# EAGLE design Pro_Shield_V2 (EAGLE 7.1.0)
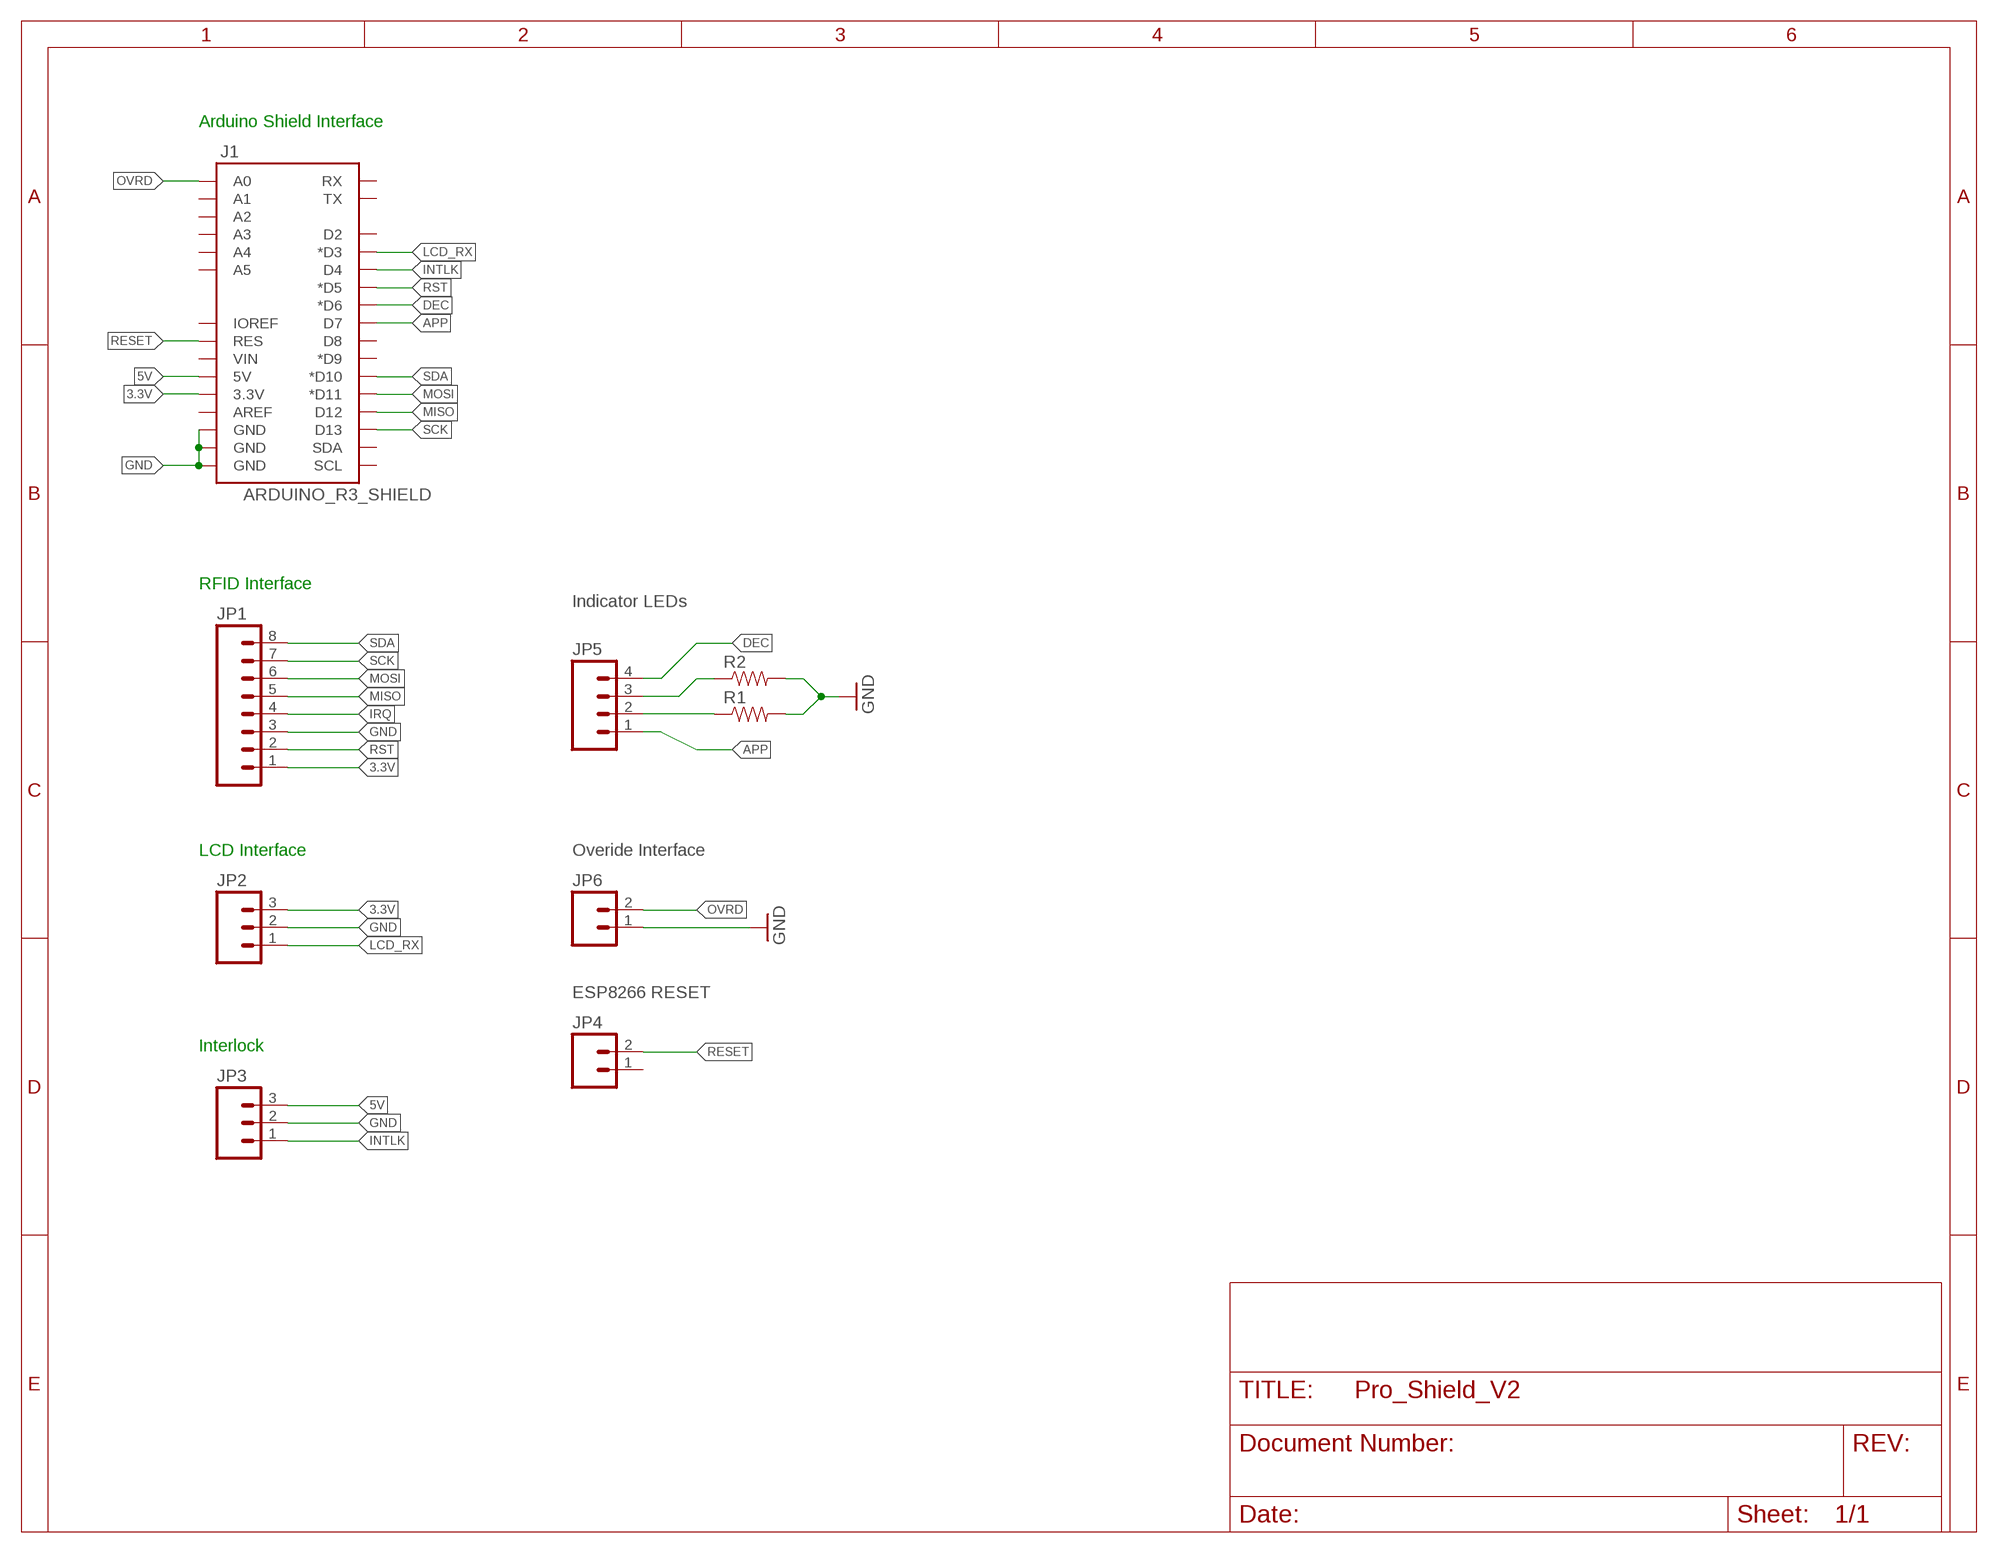
[diagram p0: schematic, sheet 1]

## Parts
J1  ARDUINO_R3_SHIELD  [UNO_R3_SHIELD]
JP1  M08LONGPADS  [1X08_LONGPADS]
JP2  M03LONGPADS  [1X03_LONGPADS]
JP3  M03LONGPADS  [1X03_LONGPADS]
JP4  M02LOCK_LONGPADS  [1X02_LOCK_LONGPADS]
JP5  M04LONGPADS  [1X04_LONGPADS]
JP6  M02LOCK_LONGPADS  [1X02_LOCK_LONGPADS]
R1  RESISTORPTH-1/4W  [AXIAL-0.4]
R2  RESISTORPTH-1/4W  [AXIAL-0.4]

## Nets
3.3V: J1.3.3V JP1.1 JP2.3
5V: J1.5V JP3.3
APP: J1.D7 JP5.1
DEC: J1.D6(*D6) JP5.4
GND: J1.GND@0(GND) J1.GND@1(GND) J1.GND@2(GND) JP1.3 JP2.2 JP3.2 JP6.1 R1.P$2 R2.P$2
INTLK: J1.D4 JP3.1
IRQ: JP1.4
LCD_RX: J1.D3(*D3) JP2.1
MISO: J1.D12 JP1.5
MOSI: J1.D11(*D11) JP1.6
N$6: JP5.2 R1.P$1
N$7: JP5.3 R2.P$1
OVRD: J1.A0 JP6.2
RESET: J1.RES JP4.2
RST: J1.D5(*D5) JP1.2
SCK: J1.D13 JP1.7
SDA: J1.D10(*D10) JP1.8
Unconnected: J1.A1 J1.A2 J1.A3 J1.A4 J1.A5 J1.AREF J1.D2 J1.D8 J1.D9(*D9) J1.IOREF J1.RX J1.SCL J1.SDA J1.TX J1.VIN JP4.1

## Notes on the sheet
- Arduino Shield Interface
- RFID Interface
- Indicator LEDs
- LCD Interface | Overide Interface
- ESP8266 RESET
- Interlock

## Library data of the parts
J1 = SparkFun-Boards:ARDUINO_R3_SHIELD: Shield form compatible with the Arduino Uno R3.
JP1 = SparkFun-Connectors:M08: Header 8 Standard 8-pin 0.1" header. Use with straight break away headers (SKU : PRT-00116), right angle break away headers (PRT-00553), swiss pins (PRT-00743), machine pins (PRT-00117), and female headers (PRT-00115).
JP2 JP3 = SparkFun-Connectors:M03: Header 3 Standard 3-pin 0.1" header. Use with straight break away headers (SKU : PRT-00116), right angle break away headers (PRT-00553), swiss pins (PRT-00743), machine pins (PRT-00117), and female headers (PRT-00115). Molex polarized connector foot print use with SKU : PRT-08232 with associated crimp pins and housings.
JP4 JP6 = SparkFun-Connectors:M02: Standard 2-pin 0.1" header. Use with - straight break away headers ( PRT-00116) - right angle break away headers (PRT-00553) - swiss pins (PRT-00743) - machine pins (PRT-00117) - female headers (PRT-00115) Molex polarized connector foot print use with: PRT-08233 with associated crimp pins and housings. 2.54_SCREWTERM for use with PRT-10571. 3.5mm Screw Terminal footprints for PRT-08084 5mm Screw Terminal footprints for use with PRT-08432
JP5 = SparkFun-Connectors:M04: Header 4 Standard 4-pin 0.1" header. Use with straight break away headers (SKU : PRT-00116), right angle break away headers (PRT-00553), swiss pins (PRT-00743), machine pins (PRT-00117), and female headers (PRT-00115). Molex polarized connector foot print use with SKU : PRT-08231 with associated crimp pins and housings. 1MM SMD Version SKU: PRT-10208
R1 R2 = SparkFun-Resistors:RESISTOR: Resistor Basic schematic elements and footprints for 0603, 1206, and PTH resistors.

## Board
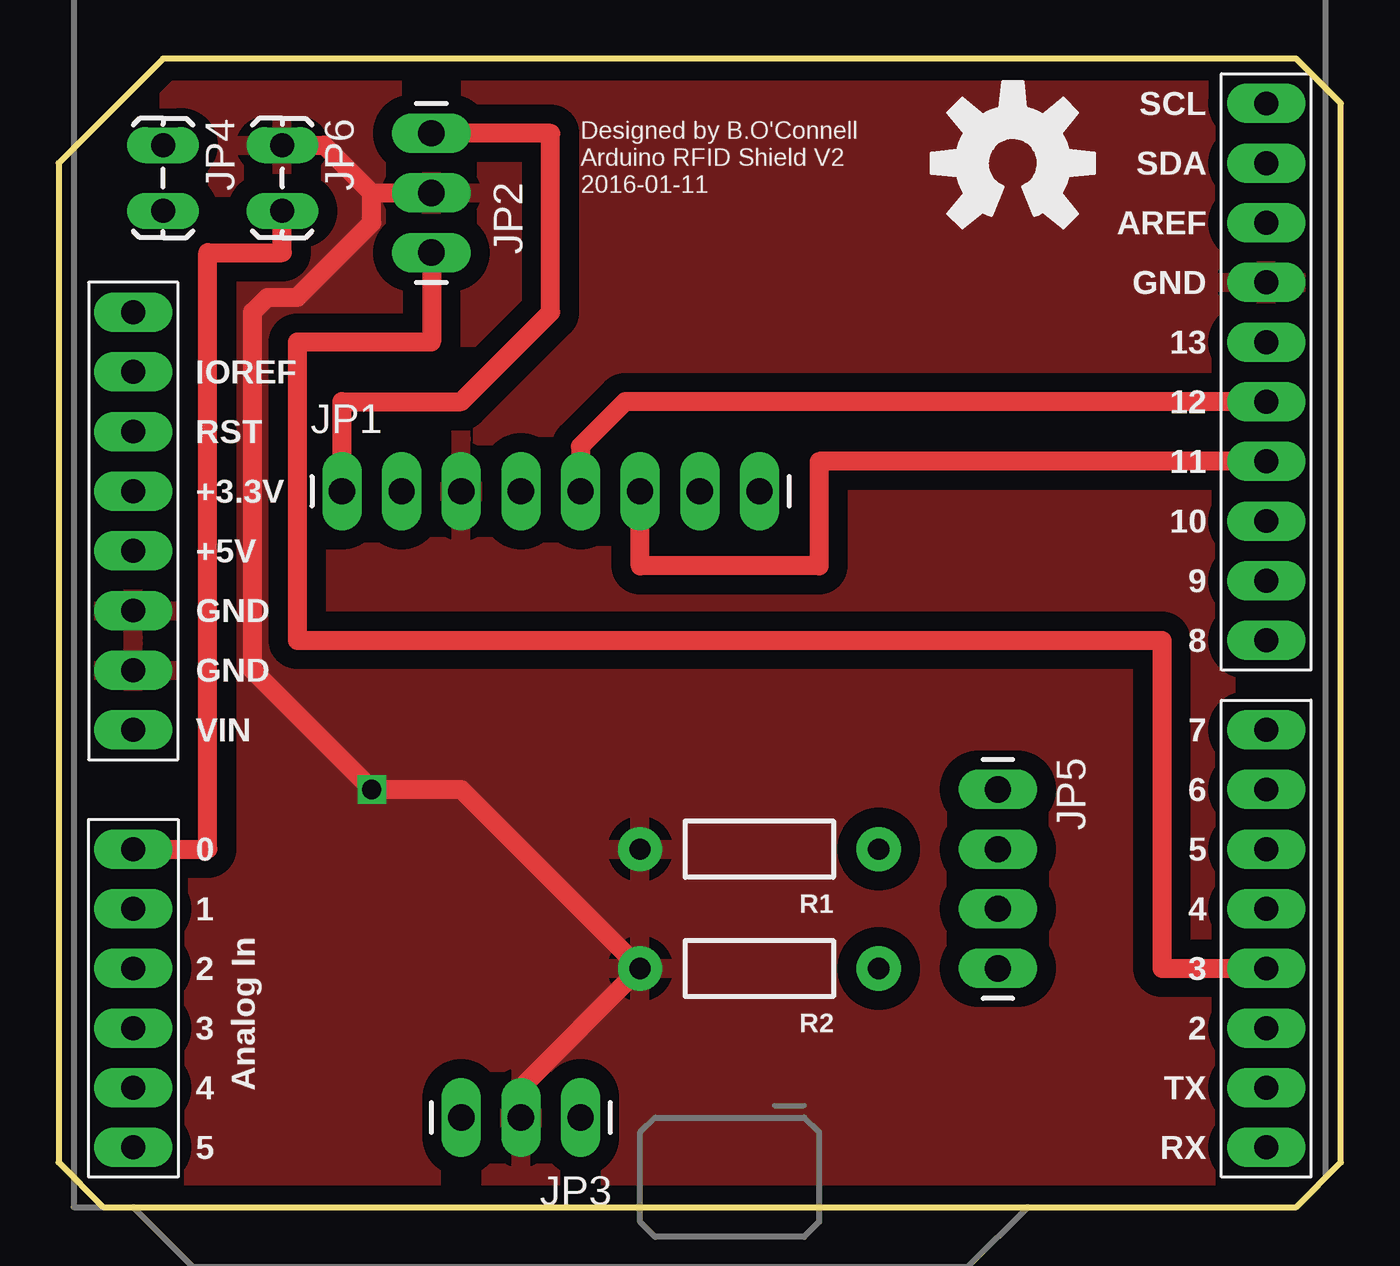
[diagram p1: board, top side]
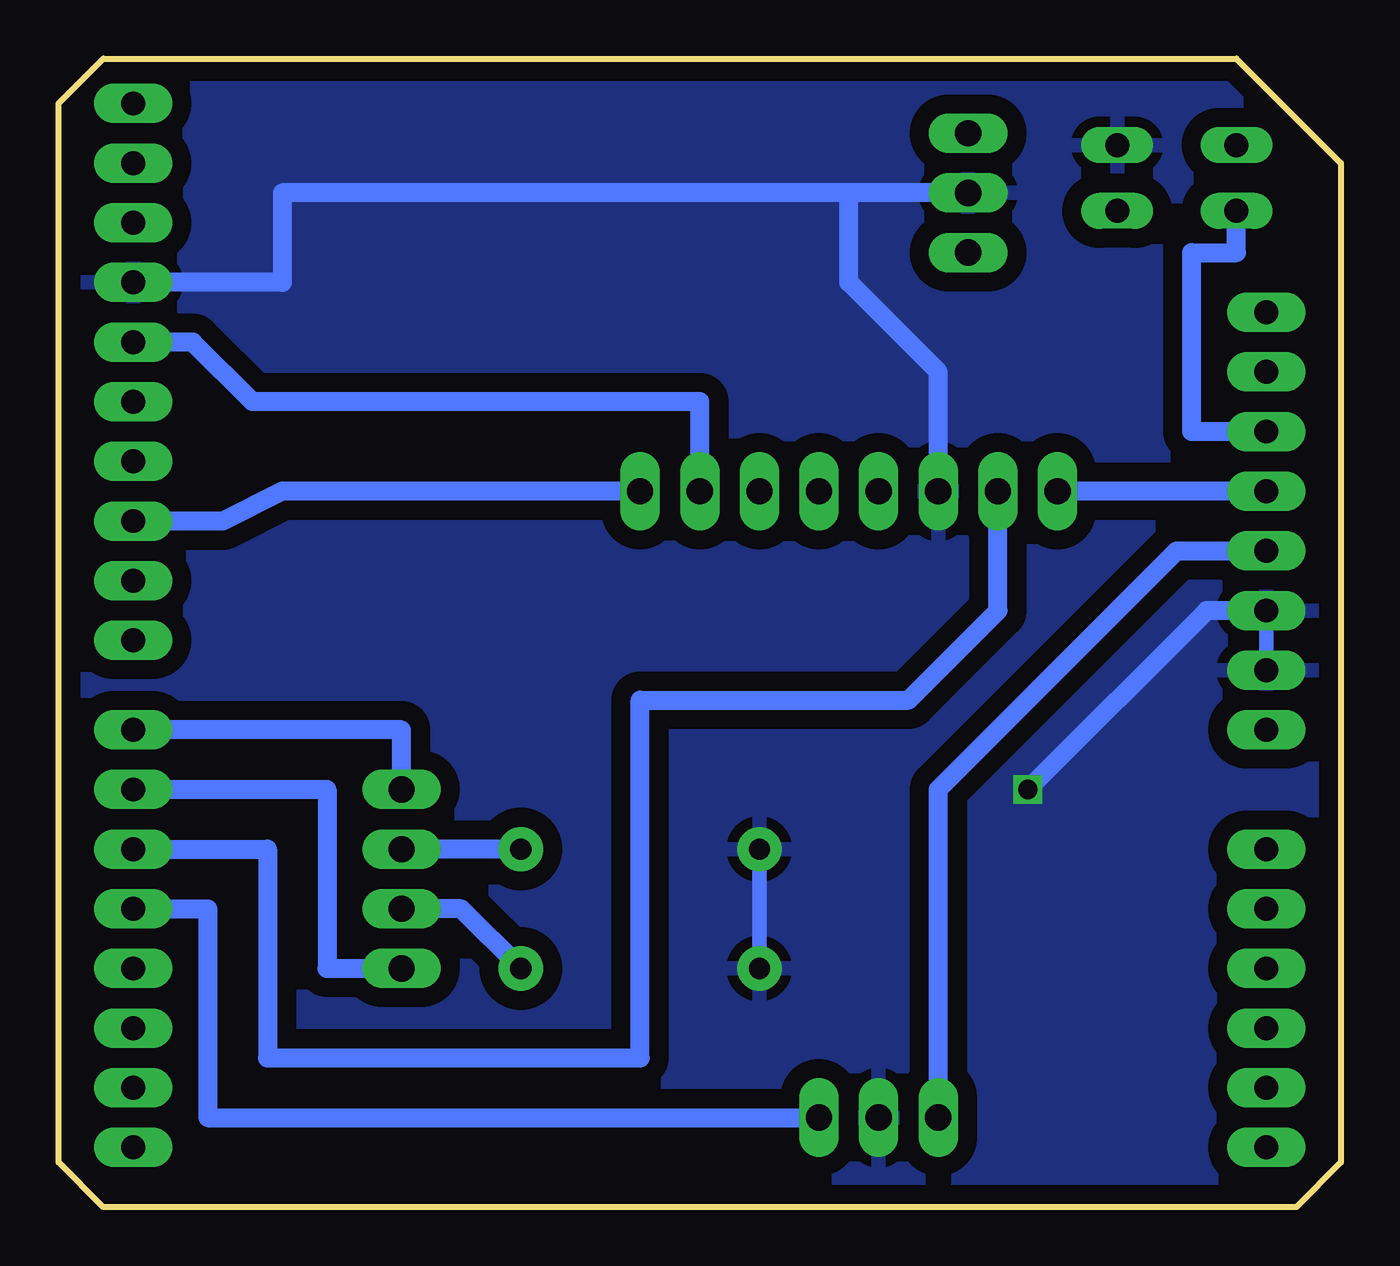
[diagram p2: board, bottom side, seen from below]

Size 54.61 x 48.9 mm. Coordinates in mm from the lower left corner, seen from the top.
Outline: 52.7,0 54.61,1.91 54.61,46.99 52.7,48.9 4.45,48.9 0,44.45 0,1.91 1.91,0 52.7,0
Copper layers (1*16): Top 0.035mm / dielectric 1.5mm / Bottom 0.035mm
Design rules "default *": minimum track width 24mil, minimum drill 24mil, track to track 32mil, track to pad 32mil, pad to pad 16mil, via to via 16mil, smd to smd 16mil, copper to edge 24mil, drill to drill 8mil, minimum pad ring 10mil, minimum via ring 8mil, stop-mask expansion 4mil, vias tented up to drill 0mil, thermal gap 18mil

### Footprints (pad centres in the part's own frame; a part is rotated, then mirrored left to right if it is on the bottom)
UNO_R3_SHIELD = drill 1.016 pad 1.676 long: 3.3V 50.8,26.67; 5V 50.8,29.21; A0 50.8,41.91; A1 50.8,44.45; A2 50.8,46.99; A3 50.8,49.53; A4 50.8,52.07; A5 50.8,54.61; AREF 2.54,15.24; D2 2.54,49.53; D3 2.54,46.99; D4 2.54,44.45; D5 2.54,41.91; D6 2.54,39.37; D7 2.54,36.83; D8 2.54,33.02; D9 2.54,30.48; D10 2.54,27.94; D11 2.54,25.4; D12 2.54,22.86; D13 2.54,20.32; GND@0 50.8,31.75; GND@1 50.8,34.29; GND@2 2.54,17.78; IOREF 50.8,21.59; NC 50.8,19.05; RES 50.8,24.13; RX 2.54,54.61; SCL 2.54,10.16; SDA 2.54,12.7; TX 2.54,52.07; VIN 50.8,36.83
1X08_LONGPADS = drill 1.118 pad 1.676 long: 1 0,0; 2 2.54,0; 3 5.08,0; 4 7.62,0; 5 10.16,0; 6 12.7,0; 7 15.24,0; 8 17.78,0
1X03_LONGPADS = drill 1.118 pad 1.676 long: 1 0,0; 2 2.54,0; 3 5.08,0
1X02_LOCK_LONGPADS = drill 1.016 long: 1 -0.127,0; 2 2.667,0
1X04_LONGPADS = drill 1.118 pad 1.676 long: 1 0,0; 2 2.54,0; 3 5.08,0; 4 7.62,0
AXIAL-0.4 = drill 0.9 pad 1.88: P$1 -5.08,0; P$2 5.08,0

### Placement (x,y rotation side)
J1  53.98,57.15 180 top
JP1  12.06,30.48 0 top
JP2  15.88,40.64 90 top
JP3  22.23,3.81 180 top
JP4  4.45,45.09 270 top
JP5  40.01,17.78 270 top
JP6  9.53,45.09 270 top
R1  29.84,15.24 180 top
R2  29.84,10.16 180 top
U$1  [OSHW-LOGO-L]  40.64,44.45 0 top

### Tracks (layer width: path | path; a pad name or v marks a point on that pad's centre or on a via)
3.3V
  Top 0.813: JP1.1 12.06,34.29 17.14,34.29 20.95,38.1 20.95,45.72 JP2.3
  Bottom 0.813: J1.3.3V JP1.1
5V
  Bottom 0.813: J1.5V 6.99,27.94 17.14,17.78 JP3.3
APP
  Bottom 0.813: J1.D7 40.01,20.32 JP5.1
DEC
  Bottom 0.813: J1.D6 43.18,17.78 43.18,10.16 JP5.4
GND  (via drill 0.81)
  Top 0.813: JP3.2 19.68,5.08 R2.P$2 17.14,17.78 v13.34,17.78 8.26,22.86 8.26,38.1 8.89,38.73 10.16,38.73 13.34,41.91 13.34,43.18 | JP6.1 11.3,45.21 13.34,43.18 | 13.34,43.18 JP2.2
  Bottom 0.61: J1.GND@1 J1.GND@0 | R1.P$2 R2.P$2
  Bottom 0.813: JP2.2 20.95,43.18 | 20.95,43.18 45.09,43.18 45.09,39.37 J1.GND@2 | J1.GND@0 5.71,25.4 v13.34,17.78 | JP1.3 17.14,35.56 20.95,39.37 20.95,43.18
  pour Bottom (isolate 0.813): 53.98,48.26 0.64,48.26 0.64,0.64 53.98,0.64
  pour Top (isolate 0.813): 1.91,1.27 52.7,1.27 52.7,48.26 1.91,48.26
INTLK
  Bottom 0.813: JP3.1 48.26,3.81 48.26,12.7 J1.D4
LCD_RX
  Top 0.813: JP2.1 15.88,36.83 10.16,36.83 10.16,24.13 46.99,24.13 46.99,10.16 J1.D3
MISO
  Top 0.813: J1.D12 24.13,34.29 22.23,32.38 JP1.5
MOSI
  Top 0.813: J1.D11 32.38,31.75 32.38,27.3 24.77,27.3 JP1.6
N$6
  Bottom 0.813: R1.P$1 JP5.2
N$7
  Bottom 0.813: JP5.3 37.47,12.7 R2.P$1
OVRD
  Top 0.813: J1.A0 6.35,15.24 6.35,40.64 9.53,40.64 JP6.2
RESET
  Bottom 0.813: J1.RES 6.35,33.02 6.35,40.64 4.45,40.64 JP4.2
RST
  Bottom 0.61: J1.D5 52.7,15.24
  Bottom 0.813: J1.D5 45.72,15.24 45.72,6.35 29.84,6.35 29.84,21.59 18.41,21.59 14.61,25.4 JP1.2
SCK
  Bottom 0.813: JP1.7 27.3,34.29 46.35,34.29 48.9,36.83 J1.D13
SDA
  Bottom 0.813: J1.D10 47.62,29.21 45.09,30.48 JP1.8

### Text on the board
tPlace: Designed by B.O'Connell / Arduino RFID Shield V2 / 2016-01-11